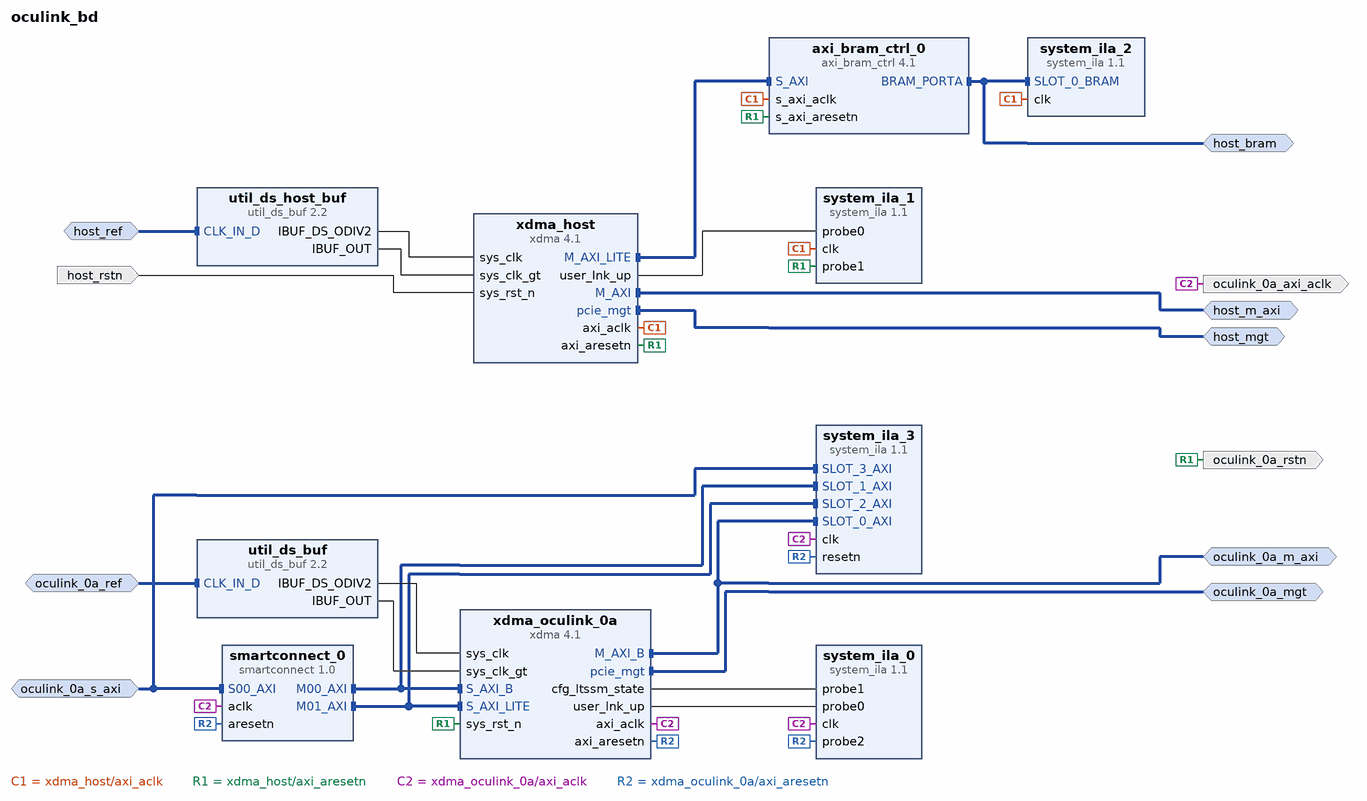
[diagram p0: block diagram of the top level]
# Vivado block design oculink_bd, xczu19eg-ffvd1760-2-e, Vivado 2021.2
create_bd_design oculink_bd

create_bd_intf_port -mode Master -vlnv xilinx.com:interface:pcie_7x_mgt_rtl:1.0 host_mgt
create_bd_intf_port -mode Slave -vlnv xilinx.com:interface:diff_clock_rtl:1.0 host_ref
set_property -dict {CONFIG.FREQ_HZ 100000000} [get_bd_intf_ports host_ref]
create_bd_intf_port -mode Master -vlnv xilinx.com:interface:pcie_7x_mgt_rtl:1.0 oculink_0a_mgt
create_bd_intf_port -mode Slave -vlnv xilinx.com:interface:diff_clock_rtl:1.0 oculink_0a_ref
set_property -dict {CONFIG.FREQ_HZ 100000000} [get_bd_intf_ports oculink_0a_ref]
create_bd_intf_port -mode Master -vlnv xilinx.com:interface:aximm_rtl:1.0 oculink_0a_m_axi
set_property -dict [list \
  CONFIG.ADDR_WIDTH 32 \
  CONFIG.DATA_WIDTH 256 \
  CONFIG.FREQ_HZ 125000000 \
  CONFIG.HAS_BURST 0 \
  CONFIG.HAS_QOS 0 \
  CONFIG.HAS_REGION 0 \
  CONFIG.NUM_READ_OUTSTANDING 8 \
  CONFIG.NUM_WRITE_OUTSTANDING 16 \
  CONFIG.PROTOCOL AXI4 \
] [get_bd_intf_ports oculink_0a_m_axi]
create_bd_intf_port -mode Slave -vlnv xilinx.com:interface:aximm_rtl:1.0 oculink_0a_s_axi
set_property -dict [list \
  CONFIG.ADDR_WIDTH 32 \
  CONFIG.ARUSER_WIDTH 0 \
  CONFIG.AWUSER_WIDTH 0 \
  CONFIG.BUSER_WIDTH 0 \
  CONFIG.DATA_WIDTH 256 \
  CONFIG.FREQ_HZ 125000000 \
  CONFIG.HAS_BRESP 1 \
  CONFIG.HAS_BURST 1 \
  CONFIG.HAS_CACHE 0 \
  CONFIG.HAS_LOCK 0 \
  CONFIG.HAS_PROT 0 \
  CONFIG.HAS_QOS 0 \
  CONFIG.HAS_REGION 1 \
  CONFIG.HAS_RRESP 1 \
  CONFIG.HAS_WSTRB 1 \
  CONFIG.ID_WIDTH 4 \
  CONFIG.MAX_BURST_LENGTH 256 \
  CONFIG.NUM_READ_OUTSTANDING 8 \
  CONFIG.NUM_READ_THREADS 1 \
  CONFIG.NUM_WRITE_OUTSTANDING 8 \
  CONFIG.NUM_WRITE_THREADS 1 \
  CONFIG.PROTOCOL AXI4 \
  CONFIG.READ_WRITE_MODE READ_WRITE \
  CONFIG.RUSER_BITS_PER_BYTE 0 \
  CONFIG.RUSER_WIDTH 0 \
  CONFIG.SUPPORTS_NARROW_BURST 1 \
  CONFIG.WUSER_BITS_PER_BYTE 0 \
  CONFIG.WUSER_WIDTH 0 \
  CONFIG.master_id 1 \
] [get_bd_intf_ports oculink_0a_s_axi]
create_bd_intf_port -mode Master -vlnv xilinx.com:interface:bram_rtl:1.0 host_bram
set_property -dict {CONFIG.MASTER_TYPE BRAM_CTRL CONFIG.READ_WRITE_MODE READ_WRITE} [get_bd_intf_ports host_bram]
create_bd_intf_port -mode Master -vlnv xilinx.com:interface:aximm_rtl:1.0 host_m_axi
set_property -dict [list \
  CONFIG.ADDR_WIDTH 64 \
  CONFIG.DATA_WIDTH 512 \
  CONFIG.FREQ_HZ 250000000 \
  CONFIG.HAS_BURST 0 \
  CONFIG.HAS_QOS 0 \
  CONFIG.HAS_REGION 0 \
  CONFIG.NUM_READ_OUTSTANDING 32 \
  CONFIG.NUM_WRITE_OUTSTANDING 16 \
  CONFIG.PROTOCOL AXI4 \
] [get_bd_intf_ports host_m_axi]
create_bd_port -dir I -type rst host_rstn
set_property -dict {CONFIG.POLARITY ACTIVE_LOW} [get_bd_ports host_rstn]
create_bd_port -dir O -type clk oculink_0a_axi_aclk
set_property -dict [list \
  CONFIG.ASSOCIATED_BUSIF oculink_0a_m_axi:oculink_0a_s_axi \
  CONFIG.FREQ_HZ 125000000 \
] [get_bd_ports oculink_0a_axi_aclk]
create_bd_port -dir O -type rst oculink_0a_rstn

create_bd_cell -type ip -vlnv xilinx.com:ip:xdma:4.1 xdma_host
set_property -dict [list \
  CONFIG.PF0_DEVICE_ID_mqdma 903F \
  CONFIG.PF0_SRIOV_VF_DEVICE_ID A03F \
  CONFIG.PF2_DEVICE_ID_mqdma 923F \
  CONFIG.PF3_DEVICE_ID_mqdma 933F \
  CONFIG.axi_data_width 512_bit \
  CONFIG.axil_master_64bit_en true \
  CONFIG.axilite_master_en true \
  CONFIG.axilite_master_scale Kilobytes \
  CONFIG.axilite_master_size 64 \
  CONFIG.axisten_freq 250 \
  CONFIG.en_gt_selection false \
  CONFIG.mode_selection Advanced \
  CONFIG.pf0_device_id 903F \
  CONFIG.pl_link_cap_max_link_speed 8.0_GT/s \
  CONFIG.pl_link_cap_max_link_width X16 \
  CONFIG.plltype QPLL1 \
  CONFIG.xdma_axi_intf_mm AXI_Memory_Mapped \
  CONFIG.xdma_pcie_64bit_en true \
  CONFIG.xdma_rnum_chnl 4 \
  CONFIG.xdma_wnum_chnl 4 \
] [get_bd_cells xdma_host]
create_bd_cell -type ip -vlnv xilinx.com:ip:util_ds_buf:2.2 util_ds_host_buf
set_property -dict {CONFIG.C_BUF_TYPE IBUFDSGTE} [get_bd_cells util_ds_host_buf]
create_bd_cell -type ip -vlnv xilinx.com:ip:xdma:4.1 xdma_oculink_0a
set_property -dict [list \
  CONFIG.BASEADDR 0x00000000 \
  CONFIG.HIGHADDR 0x001FFFFF \
  CONFIG.PF0_DEVICE_ID_mqdma 9034 \
  CONFIG.PF0_SRIOV_VF_DEVICE_ID A034 \
  CONFIG.PF2_DEVICE_ID_mqdma 9234 \
  CONFIG.PF3_DEVICE_ID_mqdma 9334 \
  CONFIG.axi_addr_width 32 \
  CONFIG.axi_data_width 256_bit \
  CONFIG.axisten_freq 125 \
  CONFIG.bridge_burst true \
  CONFIG.device_port_type Root_Port_of_PCI_Express_Root_Complex \
  CONFIG.dma_reset_source_sel Phy_Ready \
  CONFIG.en_gt_selection true \
  CONFIG.functional_mode AXI_Bridge \
  CONFIG.mode_selection Advanced \
  CONFIG.pcie_blk_locn X0Y3 \
  CONFIG.pf0_bar0_enabled false \
  CONFIG.pf0_bar0_type_mqdma Memory \
  CONFIG.pf0_base_class_menu Bridge_device \
  CONFIG.pf0_base_class_menu_mqdma Bridge_device \
  CONFIG.pf0_class_code_base_mqdma 06 \
  CONFIG.pf0_class_code_interface 00 \
  CONFIG.pf0_class_code_sub 07 \
  CONFIG.pf0_device_id 9134 \
  CONFIG.pf0_sriov_bar0_type Memory \
  CONFIG.pf0_sub_class_interface_menu CardBus_bridge \
  CONFIG.pf1_bar0_type_mqdma Memory \
  CONFIG.pf1_base_class_menu Bridge_device \
  CONFIG.pf1_base_class_menu_mqdma Bridge_device \
  CONFIG.pf1_class_code_base_mqdma 06 \
  CONFIG.pf1_class_code_interface 00 \
  CONFIG.pf1_class_code_sub 07 \
  CONFIG.pf1_sub_class_interface_menu CardBus_bridge \
  CONFIG.pf2_bar0_type_mqdma Memory \
  CONFIG.pf2_base_class_menu_mqdma Bridge_device \
  CONFIG.pf2_class_code_base_mqdma 06 \
  CONFIG.pf3_bar0_type_mqdma Memory \
  CONFIG.pf3_base_class_menu_mqdma Bridge_device \
  CONFIG.pf3_class_code_base_mqdma 06 \
  CONFIG.pl_link_cap_max_link_speed 8.0_GT/s \
  CONFIG.pl_link_cap_max_link_width X4 \
  CONFIG.plltype QPLL1 \
  CONFIG.select_quad GTY_Quad_131 \
  CONFIG.type1_membase_memlimit_enable Enabled \
  CONFIG.type1_prefetchable_membase_memlimit 64bit_Enabled \
  CONFIG.xdma_axi_intf_mm AXI_Memory_Mapped \
] [get_bd_cells xdma_oculink_0a]
create_bd_cell -type ip -vlnv xilinx.com:ip:util_ds_buf:2.2 util_ds_buf
set_property -dict {CONFIG.C_BUF_TYPE IBUFDSGTE} [get_bd_cells util_ds_buf]
create_bd_cell -type ip -vlnv xilinx.com:ip:system_ila:1.1 system_ila_0
set_property -dict {CONFIG.C_MON_TYPE NATIVE CONFIG.C_NUM_OF_PROBES 3} [get_bd_cells system_ila_0]
create_bd_cell -type ip -vlnv xilinx.com:ip:system_ila:1.1 system_ila_1
set_property -dict {CONFIG.C_MON_TYPE NATIVE CONFIG.C_NUM_OF_PROBES 2} [get_bd_cells system_ila_1]
create_bd_cell -type ip -vlnv xilinx.com:ip:axi_bram_ctrl:4.1 axi_bram_ctrl_0
set_property -dict {CONFIG.PROTOCOL AXI4LITE CONFIG.SINGLE_PORT_BRAM 1} [get_bd_cells axi_bram_ctrl_0]
create_bd_cell -type ip -vlnv xilinx.com:ip:system_ila:1.1 system_ila_2
set_property -dict {CONFIG.C_SLOT_0_INTF_TYPE xilinx.com:interface:bram_rtl:1.0} [get_bd_cells system_ila_2]
create_bd_cell -type ip -vlnv xilinx.com:ip:system_ila:1.1 system_ila_3
set_property -dict {CONFIG.C_NUM_MONITOR_SLOTS 4 CONFIG.C_SLOT 2} [get_bd_cells system_ila_3]
create_bd_cell -type ip -vlnv xilinx.com:ip:smartconnect:1.0 smartconnect_0
set_property -dict {CONFIG.NUM_MI 2 CONFIG.NUM_SI 1} [get_bd_cells smartconnect_0]

# ---- connections ----

connect_bd_intf_net [get_bd_intf_ports host_bram] [get_bd_intf_pins axi_bram_ctrl_0/BRAM_PORTA]
connect_bd_intf_net [get_bd_intf_ports host_bram] [get_bd_intf_pins system_ila_2/SLOT_0_BRAM]
connect_bd_intf_net -intf_net diff_clock_rtl_0_1 [get_bd_intf_ports host_ref] [get_bd_intf_pins util_ds_host_buf/CLK_IN_D]
connect_bd_intf_net -intf_net diff_clock_rtl_0_2 [get_bd_intf_ports oculink_0a_ref] [get_bd_intf_pins util_ds_buf/CLK_IN_D]
connect_bd_intf_net [get_bd_intf_ports oculink_0a_s_axi] [get_bd_intf_pins smartconnect_0/S00_AXI]
connect_bd_intf_net [get_bd_intf_ports oculink_0a_s_axi] [get_bd_intf_pins system_ila_3/SLOT_3_AXI]
connect_bd_intf_net [get_bd_intf_pins xdma_oculink_0a/S_AXI_B] [get_bd_intf_pins smartconnect_0/M00_AXI]
connect_bd_intf_net [get_bd_intf_pins xdma_oculink_0a/S_AXI_B] [get_bd_intf_pins system_ila_3/SLOT_1_AXI]
connect_bd_intf_net [get_bd_intf_pins xdma_oculink_0a/S_AXI_LITE] [get_bd_intf_pins smartconnect_0/M01_AXI]
connect_bd_intf_net [get_bd_intf_pins xdma_oculink_0a/S_AXI_LITE] [get_bd_intf_pins system_ila_3/SLOT_2_AXI]
connect_bd_intf_net [get_bd_intf_ports host_m_axi] [get_bd_intf_pins xdma_host/M_AXI]
connect_bd_intf_net [get_bd_intf_pins xdma_host/M_AXI_LITE] [get_bd_intf_pins axi_bram_ctrl_0/S_AXI]
connect_bd_intf_net [get_bd_intf_ports host_mgt] [get_bd_intf_pins xdma_host/pcie_mgt]
connect_bd_intf_net -intf_net xdma_oculink_M_AXI_B [get_bd_intf_ports oculink_0a_m_axi] [get_bd_intf_pins xdma_oculink_0a/M_AXI_B]
connect_bd_intf_net [get_bd_intf_ports oculink_0a_m_axi] [get_bd_intf_pins system_ila_3/SLOT_0_AXI]
connect_bd_intf_net -intf_net xdma_oculink_pcie_mgt [get_bd_intf_ports oculink_0a_mgt] [get_bd_intf_pins xdma_oculink_0a/pcie_mgt]
connect_bd_net -net reset_rtl_0_1 [get_bd_ports host_rstn] [get_bd_pins xdma_host/sys_rst_n]
connect_bd_net -net util_ds_buf_IBUF_DS_ODIV2 [get_bd_pins util_ds_host_buf/IBUF_DS_ODIV2] [get_bd_pins xdma_host/sys_clk]
connect_bd_net [get_bd_pins util_ds_buf/IBUF_DS_ODIV2] [get_bd_pins xdma_oculink_0a/sys_clk]
connect_bd_net -net util_ds_buf_IBUF_OUT [get_bd_pins util_ds_host_buf/IBUF_OUT] [get_bd_pins xdma_host/sys_clk_gt]
connect_bd_net [get_bd_pins util_ds_buf/IBUF_OUT] [get_bd_pins xdma_oculink_0a/sys_clk_gt]
connect_bd_net [get_bd_pins xdma_host/axi_aclk] [get_bd_pins system_ila_1/clk] [get_bd_pins axi_bram_ctrl_0/s_axi_aclk] [get_bd_pins system_ila_2/clk]
connect_bd_net [get_bd_pins xdma_host/axi_aresetn] \
  [get_bd_pins xdma_oculink_0a/sys_rst_n] [get_bd_pins system_ila_1/probe1] [get_bd_ports oculink_0a_rstn] \
  [get_bd_pins axi_bram_ctrl_0/s_axi_aresetn]
connect_bd_net [get_bd_pins xdma_host/user_lnk_up] [get_bd_pins system_ila_1/probe0]
connect_bd_net [get_bd_pins xdma_oculink_0a/axi_aclk] \
  [get_bd_ports oculink_0a_axi_aclk] [get_bd_pins system_ila_0/clk] [get_bd_pins system_ila_3/clk] \
  [get_bd_pins smartconnect_0/aclk]
connect_bd_net [get_bd_pins xdma_oculink_0a/axi_aresetn] \
  [get_bd_pins system_ila_0/probe2] [get_bd_pins system_ila_3/resetn] [get_bd_pins smartconnect_0/aresetn]
connect_bd_net [get_bd_pins xdma_oculink_0a/cfg_ltssm_state] [get_bd_pins system_ila_0/probe1]
connect_bd_net [get_bd_pins xdma_oculink_0a/user_lnk_up] [get_bd_pins system_ila_0/probe0]

# ---- address map ----
assign_bd_address -offset 0x00000000 -range 2G -target_address_space [get_bd_addr_spaces oculink_0a_s_axi] [get_bd_addr_segs xdma_oculink_0a/S_AXI_LITE/CTL0]
assign_bd_address -offset 0x80000000 -range 2G -target_address_space [get_bd_addr_spaces oculink_0a_s_axi] [get_bd_addr_segs xdma_oculink_0a/S_AXI_B/BAR0]
assign_bd_address -offset 0x0000000000000000 -range 512M -target_address_space [get_bd_addr_spaces xdma_host/M_AXI] [get_bd_addr_segs host_m_axi/Reg]
assign_bd_address -offset 0x00000000 -range 64K -target_address_space [get_bd_addr_spaces xdma_host/M_AXI_LITE] [get_bd_addr_segs axi_bram_ctrl_0/S_AXI/Mem0]
assign_bd_address -offset 0x00000000 -range 4G -target_address_space [get_bd_addr_spaces xdma_oculink_0a/M_AXI_B] [get_bd_addr_segs oculink_0a_m_axi/Reg]

validate_bd_design
save_bd_design
